# Altium project Control_Logic.PrjPcb (part 3 of 3)
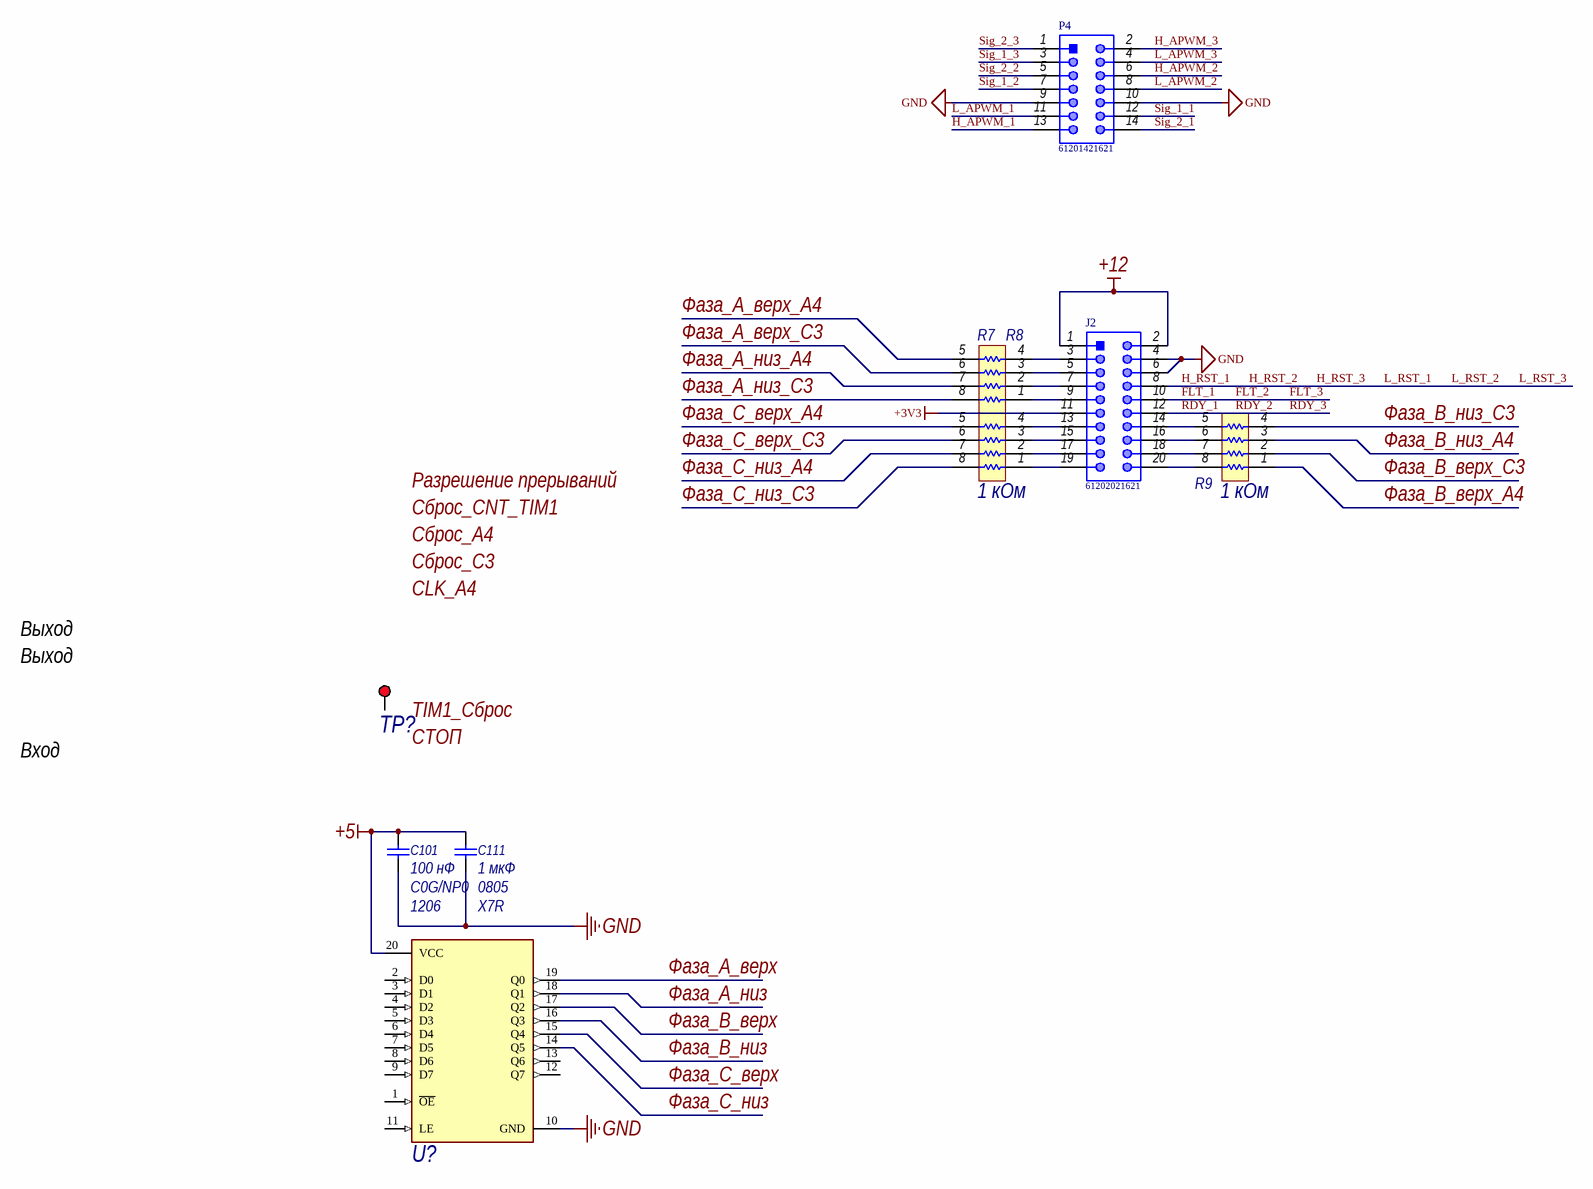
[diagram p106: PLEN_Control_Logic_pt4.SchDoc]

## Nets that join several sheets
+5: PLEN_Control_Logic_pt1 (R2.2 R13.1), PLEN_Control_Logic_pt2 (42 pins), PLEN_Control_Logic_pt3 (215 pins), PLEN_Control_Logic_pt4 (C101#2.1 C111#2.2 U?.20)
GND: PLEN_Control_Logic_pt1 (169 pins), PLEN_Control_Logic_pt2 (42 pins), PLEN_Control_Logic_pt3 (215 pins), PLEN_Control_Logic_pt4 (7 pins)
A4_Rise_D0: PLEN_Control_Logic_pt1 (C33.1 U17.2), PLEN_Control_Logic_pt3 (R93.2 SW5.16)
A4_Rise_D1: PLEN_Control_Logic_pt1 (C37.1 U17.5), PLEN_Control_Logic_pt3 (R97.2 SW5.15)
A4_Rise_D2: PLEN_Control_Logic_pt1 (C41.1 U17.10), PLEN_Control_Logic_pt3 (R101.2 SW5.14)
A4_Rise_D3: PLEN_Control_Logic_pt1 (C45.1 U17.13), PLEN_Control_Logic_pt3 (R105.2 SW5.13)
A4_Rise_D4: PLEN_Control_Logic_pt1 (C34.1 U18.2), PLEN_Control_Logic_pt3 (R109.2 SW5.12)
A4_Rise_D5: PLEN_Control_Logic_pt1 (C38.1 U18.5), PLEN_Control_Logic_pt3 (R113.2 SW5.11)
A4_Rise_D6: PLEN_Control_Logic_pt1 (C42.1 U18.10), PLEN_Control_Logic_pt3 (R117.2 SW5.10)
A4_Rise_D7: PLEN_Control_Logic_pt1 (C46.1 U18.13), PLEN_Control_Logic_pt3 (R121.2 SW5.9)
A4_Rise_D8: PLEN_Control_Logic_pt1 (C35.1 U19.2), PLEN_Control_Logic_pt3 (R94.2 SW6.16)
A4_Rise_D9: PLEN_Control_Logic_pt1 (C39.1 U19.5), PLEN_Control_Logic_pt3 (R98.2 SW6.15)
A4_Rise_D10: PLEN_Control_Logic_pt1 (C43.1 U19.10), PLEN_Control_Logic_pt3 (R102.2 SW6.14)
A4_Rise_D11: PLEN_Control_Logic_pt1 (C47.1 U19.13), PLEN_Control_Logic_pt3 (R106.2 SW6.13)
A4_Rise_D12: PLEN_Control_Logic_pt1 (C36.1 U20.2), PLEN_Control_Logic_pt3 (R110.2 SW6.12)
A4_Rise_D13: PLEN_Control_Logic_pt1 (C40.1 U20.5), PLEN_Control_Logic_pt3 (R114.2 SW6.11)
A4_Rise_D14: PLEN_Control_Logic_pt1 (C44.1 U20.10), PLEN_Control_Logic_pt3 (R118.2 SW6.10)
A4_Rise_D15: PLEN_Control_Logic_pt1 (C48.1 U20.13), PLEN_Control_Logic_pt3 (R122.2 SW6.9)
C3_Rise_D0: PLEN_Control_Logic_pt1 (C17.1 U11.2), PLEN_Control_Logic_pt3 (R61.2 SW1.16)
C3_Rise_D1: PLEN_Control_Logic_pt1 (C21.1 U11.5), PLEN_Control_Logic_pt3 (R65.2 SW1.15)
C3_Rise_D2: PLEN_Control_Logic_pt1 (C25.1 U11.10), PLEN_Control_Logic_pt3 (R69.2 SW1.14)
C3_Rise_D3: PLEN_Control_Logic_pt1 (C29.1 U11.13), PLEN_Control_Logic_pt3 (R73.2 SW1.13)
C3_Rise_D4: PLEN_Control_Logic_pt1 (C18.1 U12.2), PLEN_Control_Logic_pt3 (R77.2 SW1.12)
C3_Rise_D5: PLEN_Control_Logic_pt1 (C22.1 U12.5), PLEN_Control_Logic_pt3 (R81.2 SW1.11)
C3_Rise_D6: PLEN_Control_Logic_pt1 (C26.1 U12.10), PLEN_Control_Logic_pt3 (R85.2 SW1.10)
C3_Rise_D7: PLEN_Control_Logic_pt1 (C30.1 U12.13), PLEN_Control_Logic_pt3 (R89.2 SW1.9)
C3_Rise_D8: PLEN_Control_Logic_pt1 (C19.1 U13.2), PLEN_Control_Logic_pt3 (R62.2 SW2.16)
C3_Rise_D9: PLEN_Control_Logic_pt1 (C23.1 U13.5), PLEN_Control_Logic_pt3 (R66.2 SW2.15)
C3_Rise_D10: PLEN_Control_Logic_pt1 (C27.1 U13.10), PLEN_Control_Logic_pt3 (R70.2 SW2.14)
C3_Rise_D11: PLEN_Control_Logic_pt1 (C31.1 U13.13), PLEN_Control_Logic_pt3 (R74.2 SW2.13)
C3_Rise_D12: PLEN_Control_Logic_pt1 (C20.1 U14.2), PLEN_Control_Logic_pt3 (R78.2 SW2.12)
C3_Rise_D13: PLEN_Control_Logic_pt1 (C24.1 U14.5), PLEN_Control_Logic_pt3 (R82.2 SW2.11)
C3_Rise_D14: PLEN_Control_Logic_pt1 (C28.1 U14.10), PLEN_Control_Logic_pt3 (R86.2 SW2.10)
C3_Rise_D15: PLEN_Control_Logic_pt1 (C32.1 U14.13), PLEN_Control_Logic_pt3 (R90.2 SW2.9)
TIM1_C3_Сравнение_рост: PLEN_Control_Logic_pt1 (R14.1 U9.6), PLEN_Control_Logic_pt2 (6 pins)
TIM1_Period_D0: PLEN_Control_Logic_pt1 (C1.1 U3.2), PLEN_Control_Logic_pt3 (R125.1 R126.2)
TIM1_Period_D1: PLEN_Control_Logic_pt1 (C5.1 U3.5), PLEN_Control_Logic_pt3 (R133.1 R134.2)
TIM1_Period_D2: PLEN_Control_Logic_pt1 (C9.1 U3.10), PLEN_Control_Logic_pt3 (R141.1 R142.2)
TIM1_Period_D3: PLEN_Control_Logic_pt1 (C13.1 U3.13), PLEN_Control_Logic_pt3 (R149.1 R150.2)
TIM1_Period_D4: PLEN_Control_Logic_pt1 (C2.1 U4.2), PLEN_Control_Logic_pt3 (R127.1 R128.2)
TIM1_Period_D5: PLEN_Control_Logic_pt1 (C6.1 U4.5), PLEN_Control_Logic_pt3 (R135.1 R136.2)
TIM1_Period_D6: PLEN_Control_Logic_pt1 (C10.1 U4.10), PLEN_Control_Logic_pt3 (R143.1 R144.2)
TIM1_Period_D7: PLEN_Control_Logic_pt1 (C14.1 U4.13), PLEN_Control_Logic_pt3 (R151.1 R152.2)
TIM1_Period_D8: PLEN_Control_Logic_pt1 (C3.1 U5.2), PLEN_Control_Logic_pt3 (R129.1 R130.2)
TIM1_Period_D9: PLEN_Control_Logic_pt1 (C7.1 U5.5), PLEN_Control_Logic_pt3 (R137.1 R138.2)
TIM1_Period_D10: PLEN_Control_Logic_pt1 (C11.1 U5.10), PLEN_Control_Logic_pt3 (R145.1 R146.2)
TIM1_Period_D11: PLEN_Control_Logic_pt1 (C15.1 U5.13), PLEN_Control_Logic_pt3 (R153.1 R154.2)
TIM1_Period_D12: PLEN_Control_Logic_pt1 (C4.1 U6.2), PLEN_Control_Logic_pt3 (R131.1 R132.2)
TIM1_Period_D13: PLEN_Control_Logic_pt1 (C8.1 U6.5), PLEN_Control_Logic_pt3 (R139.1 R140.2)
TIM1_Period_D14: PLEN_Control_Logic_pt1 (C12.1 U6.10), PLEN_Control_Logic_pt3 (R147.1 R148.2)
TIM1_Period_D15: PLEN_Control_Logic_pt1 (C16.1 U6.13), PLEN_Control_Logic_pt3 (R155.1 R156.2)
TIM1_А4_Сравнение_спад: PLEN_Control_Logic_pt1 (R29.1 U35.4), PLEN_Control_Logic_pt2 (6 pins)
TIM1_Триггер: PLEN_Control_Logic_pt1 (R13.2 U10.5), PLEN_Control_Logic_pt2 (U60.8)
А4_Fall_D0: PLEN_Control_Logic_pt1 (C65.1 U29.2), PLEN_Control_Logic_pt3 (R95.2 SW7.16)
А4_Fall_D1: PLEN_Control_Logic_pt1 (C69.1 U29.5), PLEN_Control_Logic_pt3 (R99.2 SW7.15)
А4_Fall_D2: PLEN_Control_Logic_pt1 (C73.1 U29.10), PLEN_Control_Logic_pt3 (R103.2 SW7.14)
А4_Fall_D3: PLEN_Control_Logic_pt1 (C77.1 U29.13), PLEN_Control_Logic_pt3 (R107.2 SW7.13)
А4_Fall_D4: PLEN_Control_Logic_pt1 (C66.1 U30.2), PLEN_Control_Logic_pt3 (R111.2 SW7.12)
А4_Fall_D5: PLEN_Control_Logic_pt1 (C70.1 U30.5), PLEN_Control_Logic_pt3 (R115.2 SW7.11)
А4_Fall_D6: PLEN_Control_Logic_pt1 (C74.1 U30.10), PLEN_Control_Logic_pt3 (R119.2 SW7.10)
А4_Fall_D7: PLEN_Control_Logic_pt1 (C78.1 U30.13), PLEN_Control_Logic_pt3 (R123.2 SW7.9)
А4_Fall_D8: PLEN_Control_Logic_pt1 (C67.1 U31.2), PLEN_Control_Logic_pt3 (R96.2 SW8.16)
А4_Fall_D9: PLEN_Control_Logic_pt1 (C71.1 U31.5), PLEN_Control_Logic_pt3 (R100.2 SW8.15)
А4_Fall_D10: PLEN_Control_Logic_pt1 (C75.1 U31.10), PLEN_Control_Logic_pt3 (R104.2 SW8.14)
А4_Fall_D11: PLEN_Control_Logic_pt1 (C79.1 U31.13), PLEN_Control_Logic_pt3 (R108.2 SW8.13)
С3_Fall_D0: PLEN_Control_Logic_pt1 (C49.1 U23.2), PLEN_Control_Logic_pt3 (R63.2 SW3.16)
С3_Fall_D1: PLEN_Control_Logic_pt1 (C53.1 U23.5), PLEN_Control_Logic_pt3 (R67.2 SW3.15)
С3_Fall_D2: PLEN_Control_Logic_pt1 (C57.1 U23.10), PLEN_Control_Logic_pt3 (R71.2 SW3.14)
С3_Fall_D3: PLEN_Control_Logic_pt1 (C61.1 U23.13), PLEN_Control_Logic_pt3 (R75.2 SW3.13)
С3_Fall_D4: PLEN_Control_Logic_pt1 (C50.1 U24.2), PLEN_Control_Logic_pt3 (R79.2 SW3.12)
С3_Fall_D5: PLEN_Control_Logic_pt1 (C54.1 U24.5), PLEN_Control_Logic_pt3 (R83.2 SW3.11)
С3_Fall_D6: PLEN_Control_Logic_pt1 (C58.1 U24.10), PLEN_Control_Logic_pt3 (R87.2 SW3.10)
С3_Fall_D7: PLEN_Control_Logic_pt1 (C62.1 U24.13), PLEN_Control_Logic_pt3 (R91.2 SW3.9)
С3_Fall_D8: PLEN_Control_Logic_pt1 (C51.1 U25.2), PLEN_Control_Logic_pt3 (R64.2 SW4.16)
С3_Fall_D9: PLEN_Control_Logic_pt1 (C55.1 U25.5), PLEN_Control_Logic_pt3 (R68.2 SW4.15)
С3_Fall_D10: PLEN_Control_Logic_pt1 (C59.1 U25.10), PLEN_Control_Logic_pt3 (R72.2 SW4.14)
С3_Fall_D11: PLEN_Control_Logic_pt1 (C63.1 U25.13), PLEN_Control_Logic_pt3 (R76.2 SW4.13)
С3_Fall_D12: PLEN_Control_Logic_pt1 (C52.1 C68.1 U26.2 U32.2), PLEN_Control_Logic_pt3 (R80.2 R112.2 SW4.12 SW8.12)
С3_Fall_D13: PLEN_Control_Logic_pt1 (C56.1 C72.1 U26.5 U32.5), PLEN_Control_Logic_pt3 (R84.2 R116.2 SW4.11 SW8.11)
С3_Fall_D14: PLEN_Control_Logic_pt1 (C60.1 C76.1 U26.10 U32.10), PLEN_Control_Logic_pt3 (R88.2 R120.2 SW4.10 SW8.10)
С3_Fall_D15: PLEN_Control_Logic_pt1 (C64.1 C80.1 U26.13 U32.13), PLEN_Control_Logic_pt3 (R92.2 R124.2 SW4.9 SW8.9)
Фаза_A_низ: PLEN_Control_Logic_pt2 (U37.4 U37.13 U42.2), PLEN_Control_Logic_pt4 (U?.18)
Фаза_A_низ_A4: PLEN_Control_Logic_pt2 (U39.4), PLEN_Control_Logic_pt4 (R7#2.7)
Фаза_A_низ_C3: PLEN_Control_Logic_pt2 (U42.4), PLEN_Control_Logic_pt4 (R7#2.8)
Фаза_B_верх: PLEN_Control_Logic_pt2 (7 pins), PLEN_Control_Logic_pt4 (U?.17)
Фаза_B_верх_A4: PLEN_Control_Logic_pt2 (U45.4), PLEN_Control_Logic_pt4 (R9#2.1)
Фаза_B_верх_C3: PLEN_Control_Logic_pt2 (U48.4), PLEN_Control_Logic_pt4 (R9#2.2)
Фаза_B_низ: PLEN_Control_Logic_pt2 (7 pins), PLEN_Control_Logic_pt4 (U?.16)
Фаза_B_низ_A4: PLEN_Control_Logic_pt2 (U46.4), PLEN_Control_Logic_pt4 (R9#2.3)
Фаза_B_низ_C3: PLEN_Control_Logic_pt2 (U49.4), PLEN_Control_Logic_pt4 (R9#2.4)
Фаза_C_верх: PLEN_Control_Logic_pt2 (7 pins), PLEN_Control_Logic_pt4 (U?.15)
Фаза_C_верх_A4: PLEN_Control_Logic_pt2 (U52.4), PLEN_Control_Logic_pt4 (R8#2.5)
Фаза_C_верх_C3: PLEN_Control_Logic_pt2 (U55.4), PLEN_Control_Logic_pt4 (R8#2.6)
Фаза_C_низ: PLEN_Control_Logic_pt2 (7 pins), PLEN_Control_Logic_pt4 (U?.14)
Фаза_C_низ_A4: PLEN_Control_Logic_pt2 (U53.4), PLEN_Control_Logic_pt4 (R8#2.7)
Фаза_C_низ_C3: PLEN_Control_Logic_pt2 (U56.4), PLEN_Control_Logic_pt4 (R8#2.8)
Фаза_А_верх: PLEN_Control_Logic_pt2 (7 pins), PLEN_Control_Logic_pt4 (U?.19)
Фаза_А_верх_A4: PLEN_Control_Logic_pt2 (U38.4), PLEN_Control_Logic_pt4 (R7#2.5)
Фаза_А_верх_C3: PLEN_Control_Logic_pt2 (U41.4), PLEN_Control_Logic_pt4 (R7#2.6)